# Altium project ECE299_PCB.PrjPcb
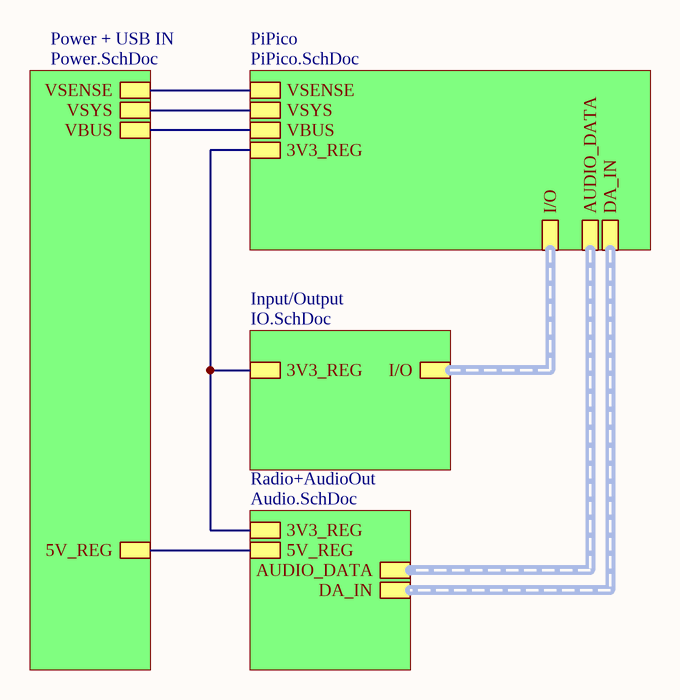
[diagram p0: Main.SchDoc]
5 sheets, 107 parts. Net scope: flat (ports and power ports of the same name join across sheets).
Board file: Main.PcbDoc
Sheets:
  Main.SchDoc
    Radio+AudioOut = Audio.SchDoc
    Input/Output = IO.SchDoc
    Power + USB IN = Power.SchDoc
    PiPico = PiPico.SchDoc

## Sheet Main.SchDoc
size A; SheetNumber: 1; SheetTotal: 5

### Sub-sheets
Input/Output = IO.SchDoc: 3V3_REG, I/O
PiPico = PiPico.SchDoc: I/O (harness IOSigHarn), VBUS, 3V3_REG, VSENSE, VSYS, AUDIO_DATA (harness AUDIO_DATA), DA_IN (harness DA_IN)
Power + USB IN = Power.SchDoc: VBUS, VSENSE, 5V_REG, VSYS
Radio+AudioOut = Audio.SchDoc: 3V3_REG, 5V_REG, AUDIO_DATA (harness AUDIO_DATA), DA_IN (harness DA_IN)

### Nets
(unnamed): sheet Radio+AudioOut/3V3_REG, sheet Input/Output/3V3_REG, sheet PiPico/3V3_REG
(unnamed): sheet Radio+AudioOut/5V_REG, sheet Power + USB IN/5V_REG
(unnamed): sheet Power + USB IN/VBUS, sheet PiPico/VBUS
(unnamed): sheet Power + USB IN/VSENSE, sheet PiPico/VSENSE
(unnamed): sheet Power + USB IN/VSYS, sheet PiPico/VSYS

### Buses and harness runs
harness sheet Input/Output/I/O = sheet PiPico/I/O
harness sheet PiPico/AUDIO_DATA = sheet Radio+AudioOut/AUDIO_DATA
harness sheet PiPico/DA_IN = sheet Radio+AudioOut/DA_IN

## Sheet Audio.SchDoc
size B; SheetNumber: 2; SheetTotal: 5
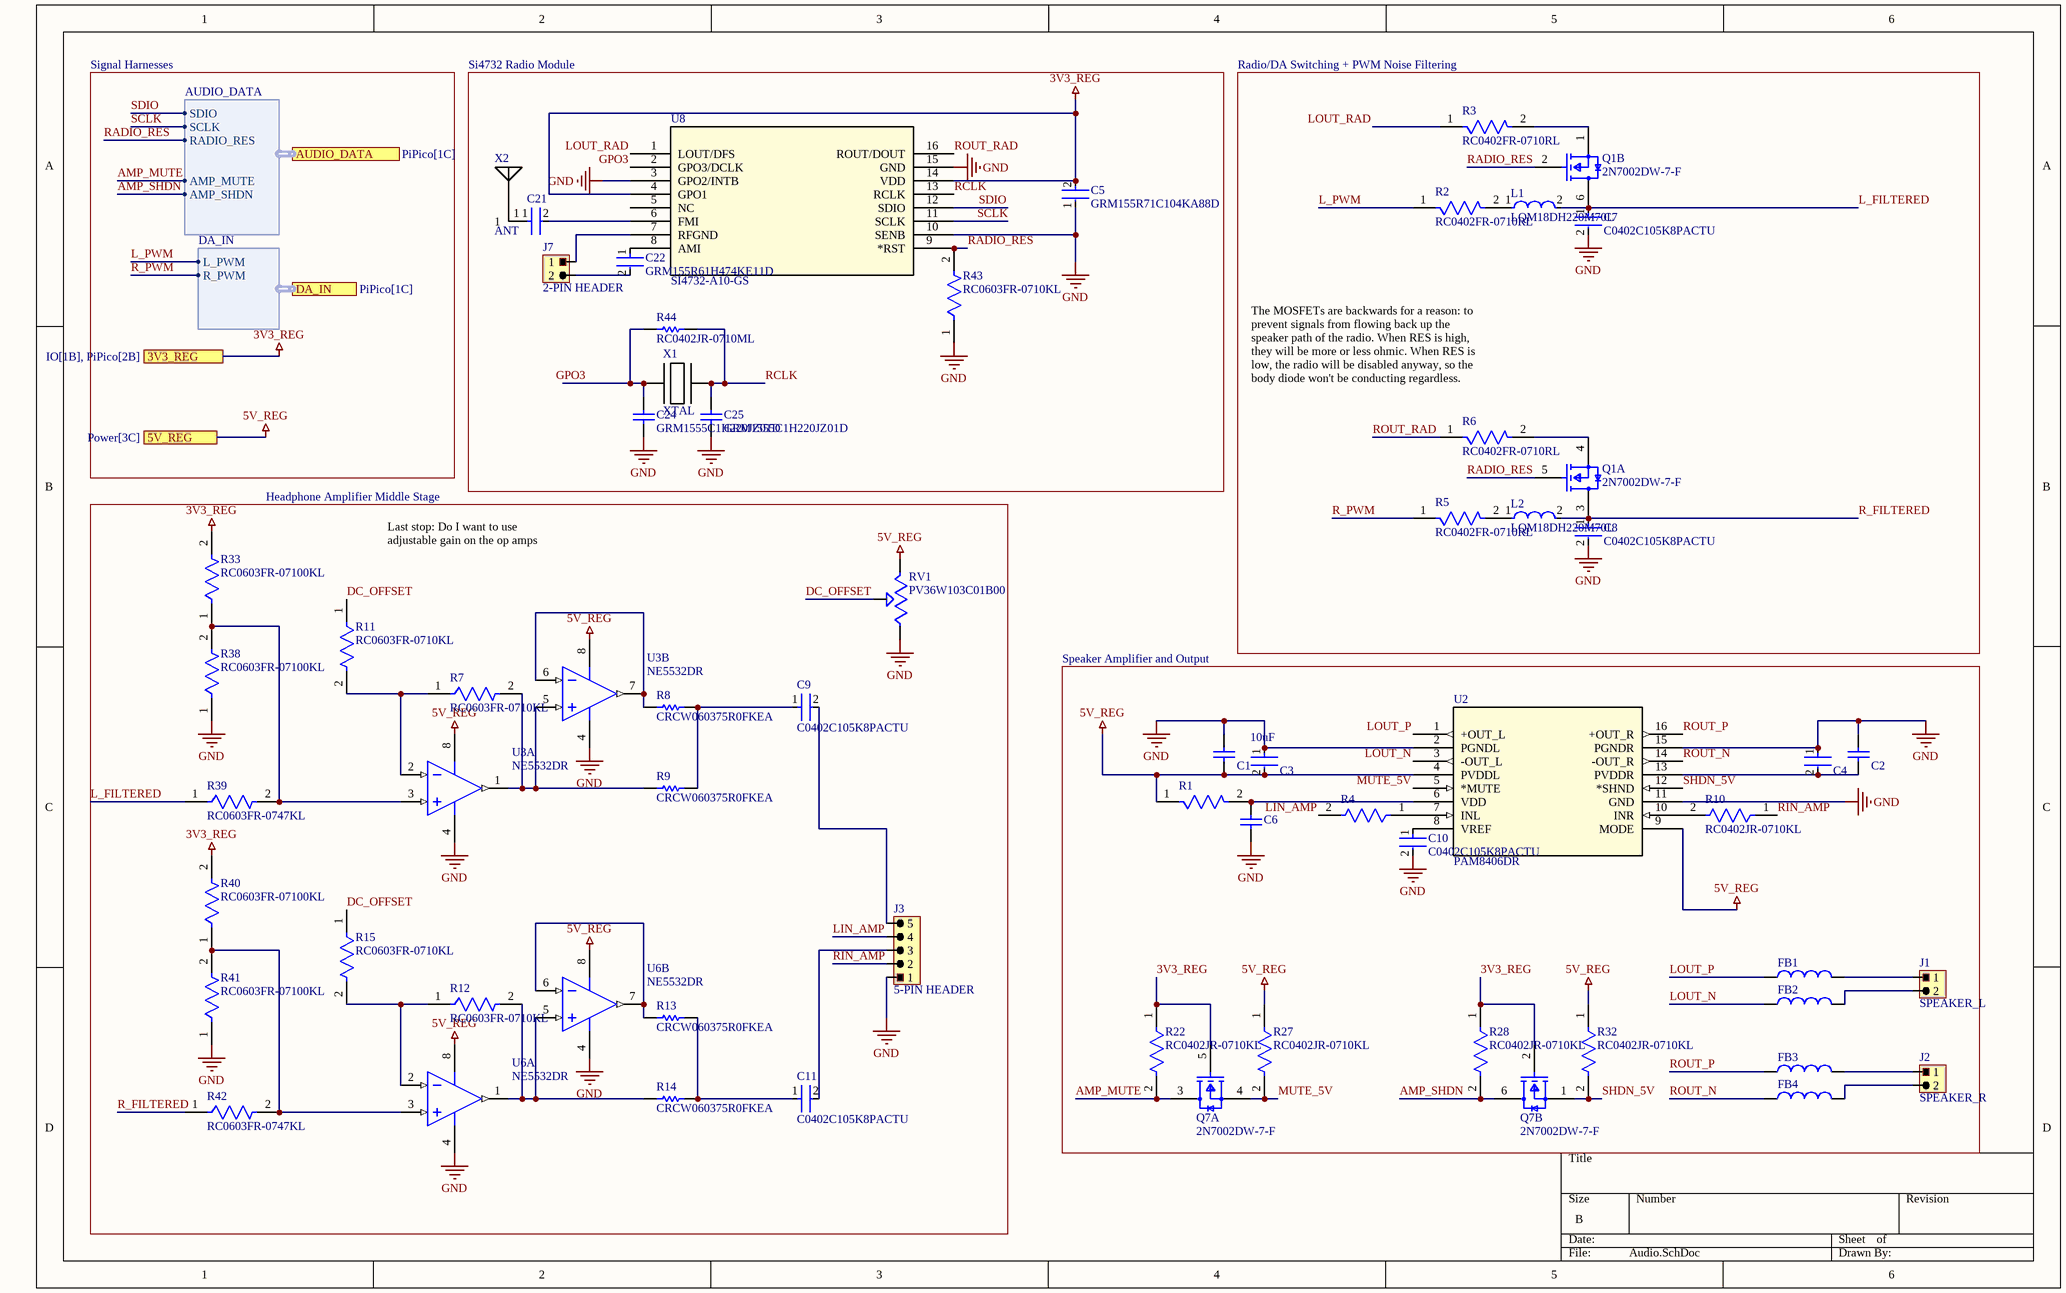
[diagram p1: Audio.SchDoc]

### Parts
C1  C0603C105K3RACTU  [CAPC1608X87X35LL15T15]  (value not drawn)
C2  C0603C105K3RACTU  [CAPC1608X87X35LL15T15]  (value not drawn)
C3  Capacitance: 10uF  [FP-C0805C-DG-MFG]  (hidden comment: C0805C106K8PACTU)
C4  C0805C106K8PACTU  [FP-C0805C-DG-MFG]  (value not drawn)
C5  GRM155R71C104KA88D  [FP-GRM15-MFG]
C6  C0603C105K3RACTU  [CAPC1608X87X35LL15T15]  (value not drawn)
C7  C0402C105K8PACTU  [FP-C0402C105K8PACTU-MFG]
C8  C0402C105K8PACTU  [FP-C0402C105K8PACTU-MFG]
C9  C0402C105K8PACTU  [FP-C0402C105K8PACTU-MFG]
C10  C0402C105K8PACTU  [FP-C0402C105K8PACTU-MFG]
C11  C0402C105K8PACTU  [FP-C0402C105K8PACTU-MFG]
C21  GRM1555C1H102JA01D  [FP-GRM155-0_05-IPC_B]  (value not drawn)
C22  GRM155R61H474KE11D  [FP-GRM155-0_1-IPC_B]
C24  GRM1555C1H220JZ01D  [CAPC1005X55X25NL05T10]
C25  GRM1555C1H220JZ01D  [CAPC1005X55X25NL05T10]
FB1  742792097  [WE-CBF_0805_L2W1.2H0.9_HC]  (value not drawn)
FB2  742792097  [WE-CBF_0805_L2W1.2H0.9_HC]  (value not drawn)
FB3  742792097  [WE-CBF_0805_L2W1.2H0.9_HC]  (value not drawn)
FB4  742792097  [WE-CBF_0805_L2W1.2H0.9_HC]  (value not drawn)
J1  SPEAKER_L  [2-pin Header (Generic)]
J2  SPEAKER_R  [2-pin Header (Generic)]
J3  5-PIN HEADER  [5-pin Header (Generic)]
J7  2-PIN HEADER  [2-pin Header (Generic)]
L1  LQM18DH220M70L  [FP-LQM18DN_70-MFG]
L2  LQM18DH220M70L  [FP-LQM18DN_70-MFG]
Q1  2N7002DW-7-F  [FP-SOT363-IPC_C]  (parts A,B of 2)
Q7  2N7002DW-7-F  [FP-SOT363-IPC_C]  (parts A,B of 2)
R1  RC0402FR-0710RL  [FP-RC0402-0_4-MFG]  (value not drawn)
R2  RC0402FR-0710RL  [FP-RC0402-0_4-MFG]
R3  RC0402FR-0710RL  [FP-RC0402-0_4-MFG]
R4  RC0402JR-0710KL  [RC0402N_YAG]  (value not drawn)
R5  RC0402FR-0710RL  [FP-RC0402-0_4-MFG]
R6  RC0402FR-0710RL  [FP-RC0402-0_4-MFG]
R7  RC0603FR-0710KL  [FP-RC0603-0_55-IPC_C]
R8  CRCW060375R0FKEA  [RESC1609X50X30LL10T20]
R9  CRCW060375R0FKEA  [RESC1609X50X30LL10T20]
R10  RC0402JR-0710KL  [RC0402N_YAG]
R11  RC0603FR-0710KL  [FP-RC0603-0_55-IPC_C]
R12  RC0603FR-0710KL  [FP-RC0603-0_55-IPC_C]
R13  CRCW060375R0FKEA  [RESC1609X50X30LL10T20]
R14  CRCW060375R0FKEA  [RESC1609X50X30LL10T20]
R15  RC0603FR-0710KL  [FP-RC0603-0_55-IPC_C]
R22  RC0402JR-0710KL  [RC0402N_YAG]
R27  RC0402JR-0710KL  [RC0402N_YAG]
R28  RC0402JR-0710KL  [RC0402N_YAG]
R32  RC0402JR-0710KL  [RC0402N_YAG]
R33  RC0603FR-07100KL  [FP-RC0603-0_55-MFG]
R38  RC0603FR-07100KL  [FP-RC0603-0_55-MFG]
R39  RC0603FR-0747KL  [FP-RC0603FR-0747KL-MFG]
R40  RC0603FR-07100KL  [FP-RC0603-0_55-MFG]
R41  RC0603FR-07100KL  [FP-RC0603-0_55-MFG]
R42  RC0603FR-0747KL  [FP-RC0603FR-0747KL-MFG]
R43  RC0603FR-0710KL  [FP-RC0603-0_55-IPC_C]
R44  RC0402JR-0710ML  [RESC1005X40X25ML05T10]
RV1  PV36W103C01B00  [TRIM_PV36W103C01B00]
U2  PAM8406DR  [SO-16_PAM8406_DIO]
U3  NE5532DR  [D0008A_N]  (parts A,B of 2)
U6  NE5532DR  [D0008A_N]  (parts A,B of 2)
U8  SI4732-A10-GS  [SOIC_A10-GS_SIL]
X1  XTAL  [FC-135 32.7680KA-AG0]
X2  ANT  [FM_ANTENNA_OUT]

### Blocks framed on the sheet
Si4732 Radio Module: C5 C21 C22 C24 C25 J7 R43 R44 U8 X1 X2
Radio/DA Switching + PWM Noise Filtering: C7 C8 L1 L2 Q1 R2 R3 R5 R6
Headphone Amplifier Middle Stage: C9 C11 J3 R7-R9 R11-R15 R33 R38-R42 RV1 U3 U6
Speaker Amplifier and Output: C1-C4 C6 C10 FB1-FB4 J1 J2 Q7 R1 R4 R10 R22 R27 R28 R32 U2

### Ports
3V3_REG (see IO[1B], PiPico[2B]), 5V_REG (see Power[3C]), AUDIO_DATA (harness AUDIO_DATA, see PiPico[1C]), DA_IN (harness DA_IN, see PiPico[1C])

### Harnesses
AUDIO_DATA: SDIO, SCLK, AMP_MUTE, AMP_SHDN, RADIO_RES
DA_IN: L_PWM, R_PWM

### Nets
3V3_REG: C5.2 Q7.2(G2) Q7.5(G1) R22.1 R28.1 R33.2 R40.2 U8.4(GPO1) U8.14(VDD) ; port 3V3_REG
5V_REG: C1.1 C3.2 R1.1 R27.1 R32.1 RV1.3 U2.4(PVDDL) U2.9(MODE) U3.8(VCC+) U6.8(VCC+) ; port 5V_REG  [project net 5V_OUT]
GND: C1.2 C2.2 C3.1 C4.1 C5.1 C6.1 C7.2 C8.2 C10.2 C24.1 C25.1 J3.1 R38.1 R41.1 R43.1 RV1.1 U2.2(PGNDL) U2.11(GND) U2.15(PGNDR) U3.4(VCC-) U6.4(VCC-) U8.3(GPO2/INTB) U8.10(SENB) U8.15(GND)
AMP_MUTE: Q7.3(D1) R22.2 ; port AUDIO_DATA.AMP_MUTE
AMP_SHDN: Q7.6(D2) R28.2 ; port AUDIO_DATA.AMP_SHDN
DC_OFFSET: R11.1 R15.1 RV1.2  [project net DC_OFFSET_2]
GPO3: C24.2 R44.1 U8.2(GPO3/DCLK) X1.2  [project net GPO3_2]
L_FILTERED: C7.1 L1.2 Q1.6(D2) R39.1  [project net L_FILTERED_2]
L_PWM: R2.1 ; port DA_IN.L_PWM
LIN_AMP: J3.4 R4.2  [project net LIN_AMP_2]
LOUT_N: FB2.1 U2.3(-OUT_L)  [project net LOUT_N_2]
LOUT_P: FB1.1 U2.1(+OUT_L)  [project net LOUT_P_2]
LOUT_RAD: R3.1 U8.1(LOUT/DFS)  [project net LOUT_RAD_2]
MUTE_5V: Q7.4(S1) R27.2 U2.5(*MUTE)  [project net MUTE_5V_2]
R_FILTERED: C8.1 L2.2 Q1.3(D1) R42.1  [project net R_FILTERED_2]
R_PWM: R5.1 ; port DA_IN.R_PWM
RADIO_RES: Q1.2(G2) Q1.5(G1) R43.2 U8.9(*RST) ; port AUDIO_DATA.RADIO_RES
RCLK: C25.2 R44.2 U8.13(RCLK) X1.1  [project net RCLK_2]
RIN_AMP: J3.2 R10.1  [project net RIN_AMP_2]
ROUT_N: FB4.1 U2.14(-OUT_R)  [project net ROUT_N_2]
ROUT_P: FB3.1 U2.16(+OUT_R)  [project net ROUT_P_2]
ROUT_RAD: R6.1 U8.16(ROUT/DOUT)  [project net ROUT_RAD_2]
SCLK: U8.11(SCLK) ; port AUDIO_DATA.SCLK  [project net I2C_SCLK]
SDIO: U8.12(SDIO) ; port AUDIO_DATA.SDIO  [project net I2C_SDIO]
SHDN_5V: Q7.1(S2) R32.2 U2.12(*SHND)  [project net SHDN_5V_2]
NetC2_1: C2.1 C4.2 U2.13(PVDDR)
NetC6_2: C6.2 R1.2 U2.6(VDD)
NetC9_1: C9.1 R8.2 R9.2
NetC9_2: C9.2 J3.5
NetC10_1: C10.1 U2.8(VREF)
NetC11_1: C11.1 R13.2 R14.2
NetC11_2: C11.2 J3.3
NetC21_1: C21.1 X2.1
NetC21_2: C21.2 U8.6(FMI)
NetC22_1: C22.1 U8.8(AMI)
NetC22_2: C22.2 J7.2
NetFB1_2: FB1.2 J1.1
NetFB2_2: FB2.2 J1.2
NetFB3_2: FB3.2 J2.1
NetFB4_2: FB4.2 J2.2
NetJ7_1: J7.1 U8.7(RFGND)
NetL1_1: L1.1 R2.2
NetL2_1: L2.1 R5.2
NetQ1_1: Q1.1(S2) R3.2
NetQ1_4: Q1.4(S1) R6.2
NetR4_1: R4.1 U2.7(INL)
NetR7_1: R7.1 R11.2 U3.2(IN1-)
NetR7_2: R7.2 R9.1 U3.1(OUT1) U3.5(IN2+)
NetR8_1: R8.1 U3.6(IN2-) U3.7(OUT2)
NetR10_2: R10.2 U2.10(INR)
NetR12_1: R12.1 R15.2 U6.2(IN1-)
NetR12_2: R12.2 R14.1 U6.1(OUT1) U6.5(IN2+)
NetR13_1: R13.1 U6.6(IN2-) U6.7(OUT2)
NetR33_1: R33.1 R38.2 R39.2 U3.3(IN1+)
NetR40_1: R40.1 R41.2 R42.2 U6.3(IN1+)

Not connected (* = marked no-connect by the designer): U8 5(NC)

### Notes on the sheet
- Signal Harnesses
- (near R6) The MOSFETs are backwards for a reason: to prevent signals from flowing back up the speaker path of the radio. When RES is high, they will be more or less ohmic. When RES is low, the radio will be disabled anyway, so the body diode won't be conducting regardless.
- Last stop: Do I want to use adjustable gain on the op amps

### Library data of the parts
C1 C2 C6 = CMP-2006-03713-1: Manufacturer: Kemet; Part Number: C0603C105K3RACTU
C3 C4 = CMP-2007-03243-2: CAP CER 10UF 10V X5R 0805; Manufacturer: Kemet; 3DS Part Number: 220-00001; Tolerance: 10%; Temperature Coefficient: 15%; Material: Ceramic; Device Class L2: Capacitors; Device Class L1: Passive Components; ComponentLink2URL: https://content.kemet.com/datasheets/KEM_C1006_X5R_SMD.pdf; Height: 1.4mm; Lead Free: Yes; Manufacturer Part Number: C0805C106K8PACTU; Digikey Description: CAP CER 10UF 10V X5R 0805; Octopart: https://octopart.com/c0805c106k8pactu-kemet-98697; Value: 10uF; Temperature Range Low: -55°C; Temperature: -55°C to +85°C; Automotive: No; Mouser Description: CAP CER 10UF 10V X5R 0805; Ipc Land Pattern Name: CAPC200125X125; Temperature Range High: +85°C; Voltage: 10V; RoHS: TRUE; Device Class L3: Ceramic Capacitors; ComponentLink2Description: Datasheet; Voltage Rating: 10V; Package: C0805C-DG; Temperature Characteristic: X5R; Category: Cap
  C4: Capacitance: 10uF
C5 = CMP-2100-03641-2: CAP CER 0.1UF 16V X7R 0402; Manufacturer: Murata; Standoff Height: 0mm; Tolerance: 10%; Description: CAP Ceramic 0.10μF 10% X7R 16Vdc 0402 SMD; Voltage Rating: 16Vdc; Material: Ceramic; Capacitance: 0.10μF; Value: 0.10μF; RoHS: TRUE; Manufacturer Part Number: GRM155R71C104KA88D; Temperature Characteristic: X7R; Octopart: https://octopart.com/grm155r71c104ka88d-murata-196880; Digikey Description: CAP CER 0.1UF 16V X7R 0402; Device Class L3: Ceramic Capacitors; Height: 0.55mm; ComponentLink2Description: Datasheet; Temperature Range Low: -55°C; Ipc Land Pattern Name: CAPC10050X219; ComponentLink2URL: https://search.murata.co.jp/Ceramy/image/img/A01X/G101/ENG/GRM155R71H471KA01-01A.pdf; Device Class L1: Passive Components; Lead Free: yes; Category: Cap; Package: GRM15; Temperature: -55°C to +125°C; Device Class L2: Capacitors; Temperature Range High: +125°C; Mouser Description: 0402 0.1 uF 16V ±10 % Tolerance X7R SMT Multilayer Ceramic Capacitor
C7-C11 = CMP-2008-02081-2: CAP CER 1UF 10V X5R 0402; Dielectric Material: Ceramic; Dissipation Factor: 5%; Tolerance: 10%; Number of Pins: 2; Contact Plating: Tin; Min Operating Temperature: -55°C; Termination: SMD/SMT; Lead Free: Lead Free; Construction: Flat; Voltage Rating (DC): 10V; Mount: Surface Mount; Series: C; Thickness: 0.022inch; Width: 0.5mm; Radiation Hardening: No; Capacitance: 1uF; Dielectric: X5R; Height: 0.5mm; Voltage: 10V; Length: 1mm; Depth: 0.5mm; Max Operating Temperature: 85°C; Package Quantity: 1; Packaging: Tape and Reel; RoHS Compliant: Yes; Case Code (Imperial): 0402; Case Code (Metric): 1005; REACH SVHC: No SVHC; Voltage Rating: 10V; Case/Package: 0402
C21 = CMP-2008-04254-2: Chip Multilayer Ceramic Capacitors for General Purpose, 0402, 1000pF, C0G, 30ppm/°C, 5%, 50V; Insulation Resistance: 10GR; Capacitance: 1nF; Packaging: Tape and Reel; Lead Free: Lead Free; Tolerance: 5%; Temperature Coefficient: 30ppm/°C; Thickness: 0.022inch; Termination: SMD/SMT; Max Operating Temperature: 125°C; Height: 0.5mm; Package Quantity: 1; Radiation Hardening: No; Material: Ceramic; Case Code (Metric): 1005; Number of Pins: 2; Voltage Rating: 50V; Mount: Surface Mount; Voltage: 50V; Case/Package: 0402; Min Operating Temperature: -55°C; Dielectric Material: Ceramic; Width: 0.5mm; Depth: 0.5mm; Case Code (Imperial): 0402; REACH SVHC: No SVHC; Dielectric: C0G; Voltage Rating (DC): 50V; Length: 1mm
C22 = CMP-06035-008741-1: Chip Multilayer Ceramic Capacitors for General Purpose, 0402, 0.47uF, X5R, 15%, 10%, 50V; Capacitance: 470nF; Dielectric: X5R; Voltage Rating (DC): 50V; Width: 500um; Tolerance: 10%; Length: 1mm; Thickness: 500um
C24 C25 = CMP-2008-04304-1: Manufacturer: Murata; Part Number: GRM1555C1H220JZ01D
FB1-FB4 = CMP-0220-00149-3: NexarPartId: 22803129; Max Current Rating: 1A; Inductance: 1.8nH; Resistance: 300mΩ; Number of Lines: 1; Test Frequency: 100MHz; Tolerance: 25%; Impedance: 1.5kΩ; Min Operating Temperature: -55°C; Core Material: Ferrite; Depth: 1.2mm; Lead Free: Lead Free; Length: 2mm; Packaging: Digi-Reel®; Case Code (Imperial): 0805; Current Rating: 1A; Max Operating Temperature: 125°C; Case Code (Metric): 2012; RoHS: Compliant; RMS Current (Irms): 1A; Mount: Surface Mount; Material: Ferrite; DC Resistance (DCR): 300mΩ; Height: 900µm; Series Resistance: 300mΩ; Termination: SMD/SMT; Max DC Current: 1A; Weight: 10.999615mg; REACH SVHC: Unknown; Width: 1.2mm; Case/Package: 0805
J1 J2 = 2-PIN HEADER
L1 L2 = CMP-00260-119446615-1: LQM18DH220M70L Inductor Chip Shielded Multilayer 22uH 20% 1MHz Ferrite 200mA 0603 Emboss T/R; Series Resistance: 3.12Ω; Self Resonant Frequency: 15MHz; Inductance: 22µH; Saturation Current: 50mA; NexarPartId: 119446615; Test Frequency: 1MHz; Resistance: 3.12Ω; Tolerance: 20%; Min Operating Temperature: -55°C; Max Operating Temperature: 150°C; RMS Current (Irms): 200mA; Lifecycle Status: Production; Height: 950µm; Case/Package: 0603; Core Material: Ferrite
Q1 Q7 = CMP-2000-05563-2: MOSFET 2N-CH 60V 0.23A SOT-363; Input Capacitance: 50pF; Rds On Max: 7.5R; Continuous Drain Current (ID): 115mA; Element Configuration: Dual; Threshold Voltage: 2V; Number of Channels: 2; Turn-Off Delay Time: 11ns; Max Power Dissipation: 200mW; Power Dissipation: 400mW; Drain to Source Breakdown Voltage: 70V; FET Type: 2 N-Channel; Turn-On Delay Time: 7ns; Drain to Source Resistance: 4.4R; Gate to Source Voltage (Vgs): 20V; Height: 1mm; REACH SVHC: No SVHC; Package Quantity: 3000; Width: 1.35mm; On-State Resistance: 7.5R; Case/Package: SOT-363; Lead Free: Lead Free; Voltage Rating (DC): 60V; Contact Plating: Tin; Drain to Source Voltage (Vdss): 60V; Packaging: Tape and Reel; Number of Pins: 6; Current Rating: 115mA; Nominal Vgs: 2V; Length: 2.2mm; Termination: SMD/SMT; Max Operating Temperature: 150°C; Dual Supply Voltage: 60V; Weight: 0.000212oz; Radiation Hardening: No; Min Operating Temperature: -55°C; Number of Elements: 2; Mount: Surface Mount
R1-R3 R5 R6 = CMP-2002-07358-2: NexarPartId: 55458463; Tolerance: 1%; Working Voltage: 50V; Power Rating: 63mW; Temperature Coefficient: 100ppm/°C; Resistance: 10Ω; Packaging: Tape & Reel; RoHS: Compliant; Case/Package: 0402; Voltage Rating (AC): 50V; Width: 500µm; Voltage Rating (DC): 50V; Termination: SMD/SMT; REACH SVHC: Unknown; Military Standard: Not; Number of Pins: 2; Lead Free: Lead Free; Schedule B: 8533210045, 8533210045; Max Operating Temperature: 155°C; Voltage Rating: 50V; Case Code (Metric): 0402; Length: 1mm; Min Operating Temperature: -55°C; Case Code (Imperial): 0402; Height: 320µm; Composition: Thick Film; Depth: 500µm; Number of Terminations: 2
R4 R10 R22 R27 R28 R32 = CMP-2002-07915-3: RES 10K OHM 5% 1/16W 0402; Max Power Dissipation: 63mW; Temperature Coefficient: 100ppm/°C; Power Rating: 62.5mW; Resistance: 10kR; Voltage Rating: 50V; Size Code: 0402; Resistance Tolerance: 5%; Packaging: Tape and Reel; Case Code (Metric): 1005; Lead Free: Lead Free; Resistor Type: Thick Film; Min Operating Temperature: -55°C; Military Standard: Not; Depth: 0.5mm; Series: RC; Case/Package: 0402; Construction: Rectangular; Number of Terminations: 2; Package Quantity: 1; Termination: SMD/SMT; Length: 0.039inch; Case Code (Imperial): 0402; Height: 0.016inch; Features: Moisture Resistant; RoHS Compliant: Yes; Max Operating Temperature: 155°C; Tolerance: 5%; Width: 0.02inch
R7 R11 R12 R15 R43 = CMP-2100-03664-2: RES 10K OHM 1% 1/10W 0603; Voltage Rating: 75V; Voltage Rating (DC): 50V; Resistance: 10kR; Power Rating: 100mW; Temperature Coefficient: 100ppm/°C; Depth: 0.8mm; Termination: SMD/SMT; Resistor Type: Thick Film; Series: RC; Construction: Rectangular; Features: Moisture Resistant; Packaging: Tape and Reel; Min Operating Temperature: -55°C; Number of Terminations: 2; Lead Pitch: 0.3mm; RoHS Compliant: Yes; Case/Package: 0603; Resistance Tolerance: 1%; Military Standard: Not; Weight: 7.1E-05oz; Number of Pins: 2; Tolerance: 1%; Length: 1.6mm; Case Code (Imperial): 0603; Lead Free: Lead Free; Width: 0.8mm; Max Power Dissipation: 100mW; Height: 0.45mm; Max Operating Temperature: 155°C; Case Code (Metric): 1608; Size Code: 0603
R8 R9 R13 R14 = CMP-2000-03573-1: Manufacturer: Vishay Dale; Part Number: CRCW060375R0FKEA
R33 R38 R40 R41 = CMP-2100-03662-2: RES SMD 100K OHM 1% 1/10W 0603; Voltage Rating (DC): 50V; Resistance: 100kR; Max Power Dissipation: 100mW; Temperature Coefficient: 100ppm/°C; Working Voltage: 75V; Length: 1.6mm; Lead Free: Lead Free; Number of Terminations: 2; Packaging: Tape and Reel; Voltage Rating: 50V; Termination: SMD/SMT; Width: 0.8mm; Resistor Type: Thick Film; Resistance Tolerance: 1%; Features: Moisture Resistant; Height: 0.45mm; Construction: Rectangular; Case/Package: 0603; Military Standard: Not; Case Code (Imperial): 0603; Series: RC; Technology: THICK FILM; Depth: 0.8mm; RoHS Compliant: Yes; REACH SVHC: No SVHC; Min Operating Temperature: -55°C; Case Code (Metric): 1608; Max Operating Temperature: 155°C; Power Rating: 100mW; Number of Pins: 2; Tolerance: 1%
R39 R42 = CMP-1659-00055-2: RES SMD 47K OHM 1% 1/10W 0603; Voltage Rating: 50V; Temperature Coefficient: 100ppm/°C; Max Power Dissipation: 100mW; Resistance: 47kR; Voltage Rating (DC): 50V; Min Operating Temperature: -55°C; Packaging: Tape and Reel; Features: Moisture Resistant; Termination: SMD/SMT; Technology: THICK FILM; Lead Free: Lead Free; Max Operating Temperature: 155°C; Width: 0.031inch; Case Code (Metric): 1608; Tolerance: 1%; Package Quantity: 1; Resistor Type: Thick Film; RoHS Compliant: Yes; Case/Package: 0603; Case Code (Imperial): 0603; Resistance Tolerance: 1%; Length: 0.063inch; Series: RC; Number of Pins: 2; Power Rating: 100mW; Number of Terminations: 2; Construction: Rectangular; Height: 0.022inch; Military Standard: Not; Size Code: 0603; Depth: 0.8mm
R44 = CMP-2002-07916-1: Manufacturer: Yageo / Phycomp; Part Number: RC0402JR-0710ML
RV1 = PV36W103C01B00: 10 kOhms 0.5W, 1/2W PC Pins Through Hole Trimmer Potentiometer Cermet 25.0 Turn Top Adjustment; MF: Bourns; DigiKey_Part_Number: 118-PV36W103C01B00-ND; Purchase-URL: https://pricing.snapeda.com/search?q=PV36W103C01B00&ref=eda; Package: PV36W Bourns; Check_prices: https://www.snapeda.com/parts/PV36W103C01B00/Bourns/view-part/?ref=eda; Value: *; SnapEDA_Link: https://www.snapeda.com/parts/PV36W103C01B00/Bourns/view-part/?ref=snap; MP: PV36W103C01B00
U2 = PAM8406DR: No Description Available; Mfr_Name: Diodes Inc; RefDes: RefDes; Type: Type
U3 U6 = CMP-0015-00074-2: Dual Low-Noise High-Speed Audio Operational Amplifier, 10 to 30 V, 0 to 70 degC, 8-pin SOIC (D8), Green (RoHS & no Sb/Br); Manufacturer: Texas Instruments; Vn at 1kHz(Typ)(nV/rtHz): 5; Total Supply Voltage(Max)(+5V is 5, +/-5V is 10): 30; Number of Channels: 2; CMRR(Min)(dB): 70; GBW(Typ)(MHz): 10; IIB(Max)(pA): 800000; Sub Family: General Purpose Amplifier, High Supply Voltage Amplifier (>=30V), Low Noise Amp (<=10nV/rtHz); Iq per channel(Max)(mA): 4; Slew Rate(Typ)(V/us): 9; ComponentLink3Description: Package Specification; Mounting Technology: Surface Mount; PackageVersion: 4040047-3/M, 06/2011; PackageReference: D0008A; ComponentLink2Description: Datasheet; PackageDescription: 8-Pin Plastic Small Outline, Body 4.9 x 3.9 mm, Pitch 1.27 mm; PartNumber: NE5532DR; ComponentLink1URL: http://www.ti.com/; ComponentLink3URL: http://www.ti.com/litv/pdf/msoi002j; Code_JEDEC: MS-012; Eco-Plan: Green (RoHS & no Sb/Br); ComponentLink1Description: Manufacturer URL; Total Supply Voltage(Min)(+5V is 5, +/-5V is 10): 10; ComponentLink2URL: http://www.ti.com/lit/ds/symlink/ne5532.pdf; Vio (25C)(Max)(mV): 4; DatasheetVersion: SLOS075I
U8 = SI4732-A10-GS: No Description Available; Mfr_Name: Silicon Labs; RefDes: RefDes; Type: Type
X1 = FC-135 32.7680KA-AG0
X2 = FM_OUT

## Sheet IO.SchDoc
size A; SheetNumber: 3; SheetTotal: 5
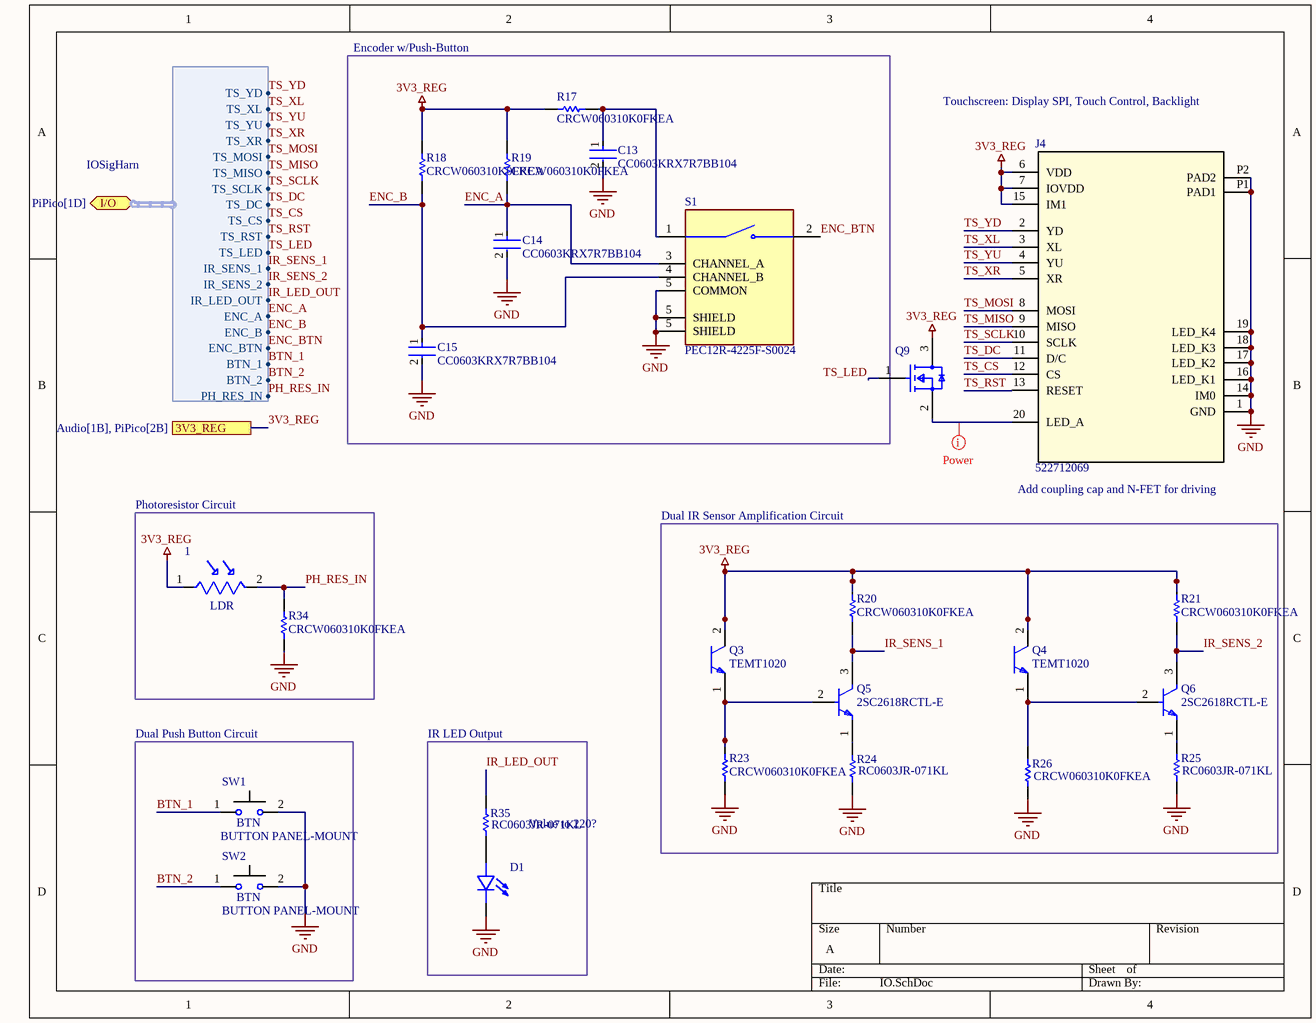
[diagram p2: IO.SchDoc]

### Parts
1  LDR  [2-pin Header (Generic)]
C13  CC0603KRX7R7BB104  [FP-CC0603-DA-MFG]
C14  CC0603KRX7R7BB104  [FP-CC0603-DA-MFG]
C15  CC0603KRX7R7BB104  [FP-CC0603-DA-MFG]
D1  (no value)  [2-pin Header (Generic)]
J4  522712069  [CON_522712069_MOL]
Q3  TEMT1020  [FP-6_544-5325_01-4-MFG]
Q4  TEMT1020  [FP-6_544-5325_01-4-MFG]
Q5  2SC2618RCTL-E  [PLSP0003ZB-A_P213_MFG]
Q6  2SC2618RCTL-E  [PLSP0003ZB-A_P213_MFG]
Q9  2N7002H6327XTSA2  [FP-PG-SOT23-3-MFG]  (value not drawn)
R17  CRCW060310K0FKEA  [RESC1609X50X30NL8T20]
R18  CRCW060310K0FKEA  [RESC1609X50X30NL8T20]
R19  CRCW060310K0FKEA  [RESC1609X50X30NL8T20]
R20  CRCW060310K0FKEA  [RESC1609X50X30NL8T20]
R21  CRCW060310K0FKEA  [RESC1609X50X30NL8T20]
R23  CRCW060310K0FKEA  [RESC1609X50X30NL8T20]
R24  RC0603JR-071KL  [RESC1608X55X25ML10T15]
R25  RC0603JR-071KL  [RESC1608X55X25ML10T15]
R26  CRCW060310K0FKEA  [RESC1609X50X30NL8T20]
R34  CRCW060310K0FKEA  [RESC1609X50X30NL8T20]
R35  RC0603JR-071KL  [RESC1608X55X25ML10T15]
S1  PEC12R-4225F-S0024  [5-pin Header (Generic)]
SW1  BUTTON PANEL-MOUNT  [2-pin Header (Generic)]
SW2  BUTTON PANEL-MOUNT  [2-pin Header (Generic)]

### Blocks framed on the sheet
Encoder w/Push-Button: C13-C15 R17-R19 S1
Photoresistor Circuit: 1 R34
Dual IR Sensor Amplification Circuit: Q3-Q6 R20 R21 R23-R26
Dual Push Button Circuit: SW1 SW2

### Ports
3V3_REG (see Audio[1B], PiPico[2B]), I/O (bidir, harness IOSigHarn, see PiPico[1D])

### Harnesses
IOSigHarn: TS_YD, TS_XL, TS_YU, TS_XR, TS_MOSI, TS_MISO, TS_SCLK, TS_DC, TS_CS, TS_RST, TS_LED, IR_SENS_1, IR_SENS_2, IR_LED_OUT, ENC_A, ENC_B, ENC_BTN, BTN_1, BTN_2, PH_RES_IN

### Nets
3V3_REG: 1.1 J4.6(VDD) J4.7(IOVDD) J4.15(IM1) Q3.2(C) Q4.2(C) Q9.3(drain) R17.2 R18.2 R19.2 R20.2 R21.2 ; port 3V3_REG
GND: C13.2 C14.2 C15.2 D1.1(C) J4.1(GND) J4.14(IM0) J4.16(LED_K1) J4.17(LED_K2) J4.18(LED_K3) J4.19(LED_K4) J4.P1(PAD1) J4.P2(PAD2) R23.1 R24.1 R25.1 R26.1 R34.1 S1.5(COMMON) SW1.2 SW2.2
BTN_1: SW1.1 ; port I/O.BTN_1
BTN_2: SW2.1 ; port I/O.BTN_2
ENC_A: C14.1 R19.1 S1.3(CHANNEL_A) ; port I/O.ENC_A
ENC_B: C15.1 R18.1 S1.4(CHANNEL_B) ; port I/O.ENC_B
ENC_BTN: S1.2 ; port I/O.ENC_BTN
IR_LED_OUT: R35.2 ; port I/O.IR_LED_OUT
IR_SENS_1: Q5.3(COLLECTOR) R20.1 ; port I/O.IR_SENS_1
IR_SENS_2: Q6.3(COLLECTOR) R21.1 ; port I/O.IR_SENS_2
PH_RES_IN: 1.2 R34.2 ; port I/O.PH_RES_IN
TS_CS: J4.12(CS) ; port I/O.TS_CS
TS_DC: J4.11(D/C) ; port I/O.TS_DC
TS_LED: Q9.1(gate) ; port I/O.TS_LED
TS_MISO: J4.9(MISO) ; port I/O.TS_MISO  [project net MISO]
TS_MOSI: J4.8(MOSI) ; port I/O.TS_MOSI  [project net MOSI]
TS_RST: J4.13(RESET) ; port I/O.TS_RST
TS_SCLK: J4.10(SCLK) ; port I/O.TS_SCLK  [project net SCLK]
TS_XL: J4.3(XL) ; port I/O.TS_XL
TS_XR: J4.5(XR) ; port I/O.TS_XR
TS_YD: J4.2(YD) ; port I/O.TS_YD
TS_YU: J4.4(YU) ; port I/O.TS_YU
NetC13_1: C13.1 R17.1 S1.1
NetD1_2: D1.2(A) R35.1
NetJ4_20: J4.20(LED_A) Q9.2(source)
NetQ3_1: Q3.1(E) Q5.2(BASE) R23.2
NetQ4_1: Q4.1(E) Q6.2(BASE) R26.2
NetQ5_1: Q5.1(EMITTER) R24.2
NetQ6_1: Q6.1(EMITTER) R25.2

### Layout directives
net class POWER: NetJ4_20

### Notes on the sheet
- Touchscreen: Display SPI, Touch Control, Backlight
- Add coupling cap and N-FET for driving
- IR LED Output
- Value to 220?
- (in symbol BUTTON PANEL-MOUNT) BTN

### Library data of the parts
1 = PHOTORESISTOR GENERIC: Generic Photoresistor symbol for peripheral use. / Uses generic 2-Pin Header footprint.
C13-C15 = CMP-2000-05002-2: CAP CER 0.1UF 16V X7R 0603; Manufacturer: YAGEO; Tolerance: 0.1; Value: 100 nF; Temperature Coefficient: 15%; Material: Ceramic; Voltage Rating: 16 V; Package: CC0603-DA; ComponentLink2Description: Datasheet; Octopart: https://octopart.com/cc0603krx7r7bb104-yageo-192941; Temperature Range High: +125°C; Digikey Description: CAP CER 0.1UF 16V X7R 0603; Voltage: 16 V; Device Class L2: Capacitors; Height: 0.9mm; Temperature: -55°C to +125°C; Manufacturer Part Number: CC0603KRX7R7BB104; Device Class L1: Passive Components; Device Class L3: Ceramic Capacitors; ComponentLink2URL: http://www.yageo.com/documents/recent/UPY-GPHC_X7R_6.3V-to-50V_18.pdf; Footprint Url: http://www.yageo.com/exep/pages/download/literatures/UPY-C_GEN_24.pdf; RoHS: TRUE; Temperature Range Low: -55°C; Temperature Characteristic: X7R; Lead Free: Yes; Capacitance: 100 nF; Category: Cap; Mouser Description: Multilayer Ceramic Capacitor, CC Series, 0.1 - F, - 10%, X7R, 16 V, 0603 [1608 Metric]; Automotive: No
D1 = APT1608SF4C-PRV: IR_LED; MF: {'manufacturer': u'Kingbright'}; Package: None; Price: None; Value: *; MP: APT1608SF4C-PRV; Availability: Unavailable
J4 = 522712069: Mfr_Name: Molex Connector Corporation; RefDes: RefDes; Type: Type
Q3 Q4 = CMP-02533-000001-1: SENSOR PHOTO 880NM TOP VIEW 2SMD; Manufacturer: Vishay Semiconductor Opto Division; Viewing Angle: 30°; Operating Supply Current: 7mA; Standoff Height: 0.08mm; Power Dissipation: 100mW; Max Junction Temp: +100°C; Collector Emitter Breakdown Voltage: 70V; Dark Current: 0.001uA; Max Collector Current: 50mA; Device Class L2: Optical Sensors; Package: 6.544-5325.01-4; ComponentLink2URL: http://www.vishay.com/doc?81554; Device Class L3: Phototransistor; Device Class L1: Sensors; Temperature: to +100°C; RoHS: TRUE; Temperature Range High: +100°C; Wavelength: 880nm; Lead Free: Yes; ComponentLink2Description: Datasheet; Category: Trans; Digikey Description: SENSOR PHOTO 880NM TOP VIEW 2SMD; Ambient Temperature Range Low: -40°C; Mouser Description: Phototransistors NPN Phototransistor; Automotive: No; Ambient Temperature Range High: +85°C; Octopart: https://octopart.com/temt1020-vishay-39666707; Manufacturer Part Number: TEMT1020; Led Orientation: Top View; Height: 2.98mm
Q5 Q6 = CMP-00572-10406399-1: Trans Gp Bjt NPN 35V 0.5A 3-PIN Mpak T/r; Manufacturer Lifecycle Status: OBSOLETE; Power Dissipation: 150mW; Emitter Base Voltage (VEBO): 4V; Number of Elements: 1; ComponentLink1Description: Manufacturer's Website; Max Operating Temperature: 150°C; Lead Free: Lead Free; ComponentLink1URL: http://www.renesas.com; China RoHS: Compliant; ComponentLink2Description: Datasheet URL; Polarity: NPN; ComponentLink3Description: Manufacturer's Package Drawing; ComponentLink3URL: https://www.renesas.com/en/document/psc/package-drawing-mpak-3pin-plsp0003zb; Width: 3mm; Min Operating Temperature: -55°C; Length: 2mm; Height: 1.3mm; Collector Emitter Voltage (VCEO): 35V; Mount: Surface Mount; Number of Pins: 3; Collector Base Voltage (VCBO): 35V; RoHS: Compliant; Radiation Hardening: No; HelpURL: https://octopart.com/cad-content/api/get-model-datasheet/15189/10406399; Lifecycle Status: Obsolete; ComponentLink2URL: https://octopart.com/cad-content/api/get-model-datasheet/15189/10406399
Q9 = CMP-32901-000180-1: MOSFET N-CH 60V 0.3A SOT23; Rise Time: 3.3ns; Input Capacitance: 20pF; Rds On Max: 3R; Gate to Source Voltage (Vgs): 20V; Continuous Drain Current (ID): 300mA; Max Power Dissipation: 500mW; Packaging: Tape and Reel; Mount: Surface Mount; Case/Package: SOT-23; Drain to Source Voltage (Vdss): 60V; Min Operating Temperature: -55°C; Halogen Free: Halogen Free; Max Dual Supply Voltage: 60V; Number of Pins: 3; Lead Free: Lead Free; Max Operating Temperature: 150°C
R17-R21 R23 R26 R34 = CMP-1666-00005-4: Chip Resistor, 10 KOhm, +/- 1%, 100 mW, -55 to 155 degC, 0603 (1608 Metric), RoHS, Tape and Reel; Manufacturer: Vishay Semiconductor; Voltage Rating: 75 V; Max Operating Temperature: 155 degC; PackageDescription: 2-Pin Surface Mount Device, Body 1.575 x 0.85 mm; ComponentLink1Description: Manufacturer URL; RoHSCompliant: true; PackageReference: 0603; REACH SVHC: Unknown; Length: 1.55 mm; DatasheetVersion: 06/2012; Packaging: Tape and Reel; Min Operating Temperature: -55 degC; Mounting Technology: Surface Mount; ComponentLink2URL: https://datasheet.ciiva.com/11809/0900766b80d98afc-11809037.pdf; Height: 0.45 mm; ComponentLink2Description: Datasheet; Package Quantity: 5000; ComponentLink1URL: http://www.vishay.com/
R24 R25 R35 = CMP-2000-05023-1: Chip Resistor, 1 KOhm, +/- 5%, 0.063 W, -55 to 155 degC, 0603 (1608 Metric), RoHS, Tape and Reel; Manufacturer: Yageo; Resistor Case Style: 0603[1608Metric]; Resistor Element Type: ThickFilm; Product Range: RCSeries; Resistance: 1kohm; SVHC: ToBeAdvised; Voltage Rating: 50V; Temperature Coefficient: ±100ppm/degC; Power Rating: 100mW; Packaging: CutTape; Manufacturer URL: http://www.yageo.com/; Resistance Tolerance: ±5%; Datasheet Version: Rev. 4, 04/2009; MSL: MSL1-Unlimited; Package Description: 2-Pin Surface Mount Device, Body 1.6 x 0.8 mm; Automotive Qualification Standard: -; Package Reference: 603; Datasheet URL: https://datasheet.ciiva.com/2452/pyu-rc0603-51-rohs-l-4-2452848.pdf
S1 = PEC12R-4225F-S0024: 24 Pulse Incremental Mechanical Rotary Encoder w/ 6 mm Flat Shaft,Through Hole | Bourns PEC12R-4225F-S0024; SnapEDA_Link: https://www.snapeda.com/parts/PEC12R-4225F-S0024/Bourns/view-part/?ref=snap; Package: None; Value: *; MF: Bourns; MP: PEC12R-4225F-S0024; Check_prices: https://www.snapeda.com/parts/PEC12R-4225F-S0024/Bourns/view-part/?ref=eda

## Sheet Power.SchDoc
size A; SheetNumber: 4; SheetTotal: 5
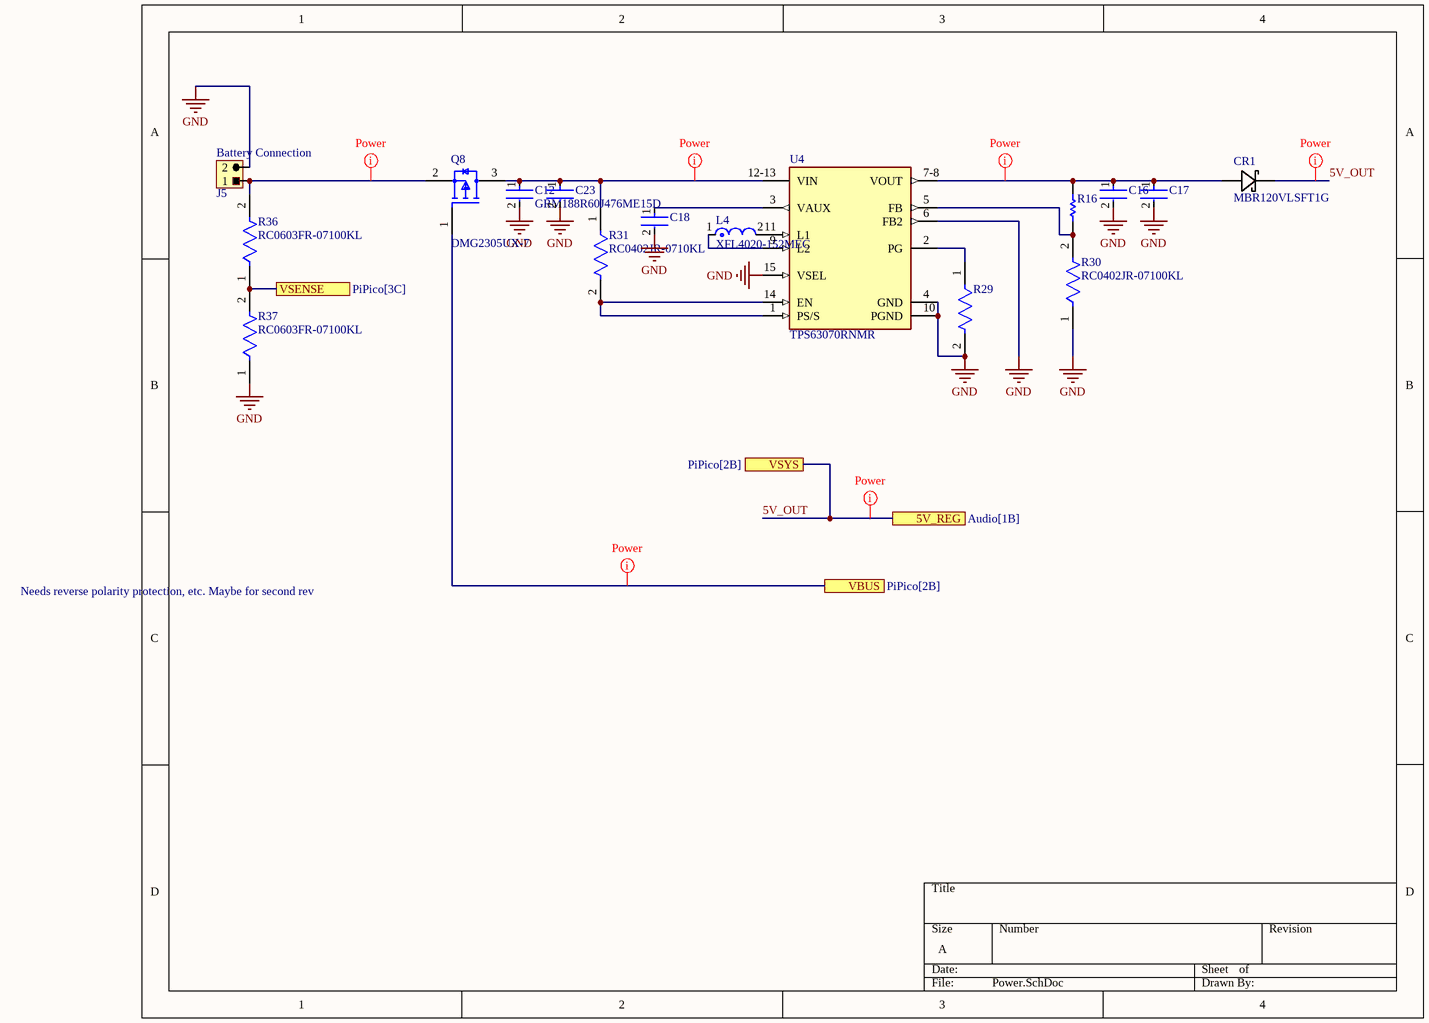
[diagram p3: Power.SchDoc]

### Parts
C12  GRM188R60J476ME15D  [FP-GRM188-0_2-IPC_B]
C16  C0603C106M9PACTU  [FP-C0603C106M9PACTU-MFG]  (value not drawn)
C17  GRM188R60J476ME15D  [FP-GRM188-0_2-IPC_B]  (value not drawn)
C18  C0402C104K8PACTU  [FP-C0402-BB-MFG]  (value not drawn)
C23  C0603C106M9PACTU  [FP-C0603C106M9PACTU-MFG]  (value not drawn)
CR1  MBR120VLSFT1G  [SDO_SOD-123FL_ONS]
J5  Battery Connection  [2-pin Header (Generic)]
L4  XFL4020-152MEC  [FP-XFL4020-MFG]
Q8  DMG2305UX-7  [FP-SOT23-IPC_B]
R16  RC0402FR-07523KL  [RESC1005X40X25NL05T10]  (value not drawn)
R29  RC0402JR-07100KL  [FP-RC0402-0_4-IPC_A]  (value not drawn)
R30  RC0402JR-07100KL  [FP-RC0402-0_4-IPC_A]
R31  RC0402JR-0710KL  [RC0402N_YAG]
R36  RC0603FR-07100KL  [FP-RC0603-0_55-MFG]
R37  RC0603FR-07100KL  [FP-RC0603-0_55-MFG]
U4  TPS63070RNMR  [FP-RNM0015A-MFG]

### Ports
5V_REG (see Audio[1B]), VBUS (see PiPico[2B]), VSENSE (see PiPico[3C]), VSYS (see PiPico[2B])

### Nets
5V_OUT: CR1.1 ; port 5V_REG, port VSYS
GND: C12.2 C16.2 C17.2 C18.2 C23.2 J5.2 R29.2 R30.1 R37.1 U4.4(GND) U4.6(FB2) U4.10(PGND) U4.15(VSEL)
VSENSE: R36.1 R37.2 ; port VSENSE
NetC12_1: C12.1 C23.1 Q8.3(DRAIN) R31.1 U4.12-13(VIN)
NetC16_1: C16.1 C17.1 CR1.2 R16.2 U4.7-8(VOUT)
NetC18_1: C18.1 U4.3(VAUX)
NetJ5_1: J5.1 Q8.2(SOURCE) R36.2
NetL4_1: L4.1 U4.9(L2)
NetL4_2: L4.2 U4.11(L1)
NetQ8_1: Q8.1(GATE) ; port VBUS
NetR16_1: R16.1 R30.2 U4.5(FB)
NetR29_1: R29.1 U4.2(PG)
NetR31_2: R31.2 U4.1(PS/S) U4.14(EN)

### Layout directives
net class POWER: 5V_OUT, NetC12_1, NetC16_1, NetJ5_1, NetQ8_1

### Notes on the sheet
- Needs reverse polarity protection, etc. Maybe for second rev

### Library data of the parts
C12 C17 = CMP-2000-05444-2: Chip Multilayer Ceramic Capacitors for General Purpose, 0603, 47uF, X5R, 15%, 20%, 6.3V; Voltage Rating (DC): 6.3V; Thickness: 0.039inch; Case Code (Imperial): 0603; Packaging: Tape and Reel; Capacitance: 47uF; Width: 0.031inch; Dielectric: X5R; Max Operating Temperature: 85°C; Mount: Surface Mount; Case Code (Metric): 1608; Length: 0.063inch; Voltage Rating: 6.3V; Tolerance: 20%; Case/Package: 0603; Min Operating Temperature: -55°C
C16 C23 = CMP-2006-02285-3: CAP CER 10UF 6.3V X5R 0603; Manufacturer: Kemet; Material: Ceramic; Temperature Coefficient: 15%; Tolerance: 20%; Manufacturer Part Number: C0603C106M9PACTU; Category: Cap; Height: 0.9mm; Digikey Description: CAP CER 10UF 6.3V X5R 0603; Mouser Description: In a Pack of 10, KEMET 0603 (1608M) 10µF MLCC 6.3V dc ±20% SMD C0603C106M9PACTU; Voltage Rating: 6.3V; Device Class L2: Capacitors; Temperature Range Low: -55°C; Temperature Characteristic: X5R; ComponentLink2Description: Datasheet; Ipc Land Pattern Name: CAPC16080X80; ComponentLink2URL: http://www.kemet.com/Lists/ProductCatalog/Attachments/19/KEM_C1006_X5R_SMD.pdf; Capacitance: 10uF; Temperature Range High: +85°C; Device Class L3: Ceramic Capacitors; RoHS: TRUE; Automotive: No; Value: 10uF; Temperature: -55°C to +85°C; Device Class L1: Passive Components; Package: C0603C106M9PACTU; Lead Free: Yes; Octopart: https://octopart.com/c0603c106m9pactu-kemet-8375727
C18 = CMP-2008-02046-2: CAP CER 0.1UF 10V X5R 0402; Manufacturer: Kemet; Material: Ceramic; Capacitance: 0.10 μF; Temperature Coefficient: 15%; Tolerance: 0.1; Value: 0.10 μF; Package: C0402-BB; Temperature: -55°C to +125°C; ComponentLink2Description: Datasheet; Temperature Characteristic: X5R; Device Class L1: Passive Components; Height: 0.55mm; Lead Free: Yes; ComponentLink2URL: https://content.kemet.com/datasheets/KEM_C1002_X7R_SMD.pdf; Device Class L2: Capacitors; Temperature Range Low: -55°C; Temperature Range High: +125°C; RoHS: TRUE; Octopart: https://octopart.com/c0402c104k8pactu-kemet-140039; Automotive: No; Mouser Description: Capacitor 100 nF 10 VDC 0402; Category: Cap; Voltage Rating: 10 V; Digikey Description: CAP CER 0.1UF 10V X5R 0402; Ipc Land Pattern Name: CAPC10050X50; Device Class L3: Ceramic Capacitors; Manufacturer Part Number: C0402C104K8PACTU
CR1 = MBR120VLSFT1G: No Description Available; Mfr_Name: onsemi
J5 = 2-PIN HEADER
L4 = CMP-11268-000104-1: Inductor Power Shielded Wirewound 1.5uH 20% 100KHz 9.1A 15.8mOhm DCR 1515 Automotive Embossed Plastic T/R; Core Material: Composite; DC Resistance (DCR): 15.8mR; Saturation Current: 4.1A; Self Resonant Frequency: 59MHz; Tolerance: 20%; Inductance: 1.5uH; Max DC Current: 9.1A; RoHS Compliant: Yes; Max Operating Temperature: 125°C; Length: 4.3mm; Case/Package: SMD/SMT; Mount: Surface Mount; Shielding: Shielded; Min Operating Temperature: -40°C; RMS Current (Irms): 9.1A; Test Frequency: 100kHz; Inductance Tolerance: 20%; REACH SVHC: No SVHC; Packaging: Tape and Reel; Termination: SMD/SMT; Lead Free: Contains Lead; Width: 4.3mm; Series: XFL4020; Height: 2.1mm
Q8 = CMP-1693-00002-4: MOSFET P-CH 20V 4.2A SOT23; Turn-On Delay Time: 10.8ns; Turn-Off Delay Time: 79.3ns; Threshold Voltage: -900mV; Rise Time: 13.7ns; Gate to Source Voltage (Vgs): 8V; Rds On Max: 52mR; Element Configuration: Single; Fall Time: 34.7ns; Max Power Dissipation: 1.4W; Drain to Source Resistance: 200mR; Number of Channels: 1; Input Capacitance: 808pF; Lead Free: Lead Free; Number of Pins: 3; Length: 3mm; Continuous Drain Current (ID): 4.2A; Contact Plating: Tin; Mount: Surface Mount; Weight: 0.000282oz; Min Operating Temperature: -55°C; Package Quantity: 3000; Drain to Source Voltage (Vdss): 20V; On-State Resistance: 52MR; Max Operating Temperature: 150°C; Height: 1.1mm; REACH SVHC: No SVHC; Packaging: Tape and Reel; Radiation Hardening: No; Case/Package: SOT-23; Width: 1.4mm
R16 = CMP-2002-07734-1: Manufacturer: Yageo / Phycomp; Part Number: RC0402FR-07523KL
R29 R30 = CMP-2002-07913-2: RES 100K OHM 5% 1/16W 0402; Temperature Coefficient: 100ppm/°C; Max Power Dissipation: 63mW; Resistance: 100kR; Voltage Rating: 50V; Tolerance: 5%; Packaging: Tape and Reel; Termination: SMD/SMT; Case Code (Metric): 1005; Length: 1mm; Power Rating: 63mW; Min Operating Temperature: -55°C; Case/Package: 0402; Construction: Rectangular; Series: RC; Resistance Tolerance: 5%; Height: 0.016inch; Case Code (Imperial): 0402; RoHS Compliant: Yes; Size Code: 0402; Number of Terminations: 2; Features: Moisture Resistant; Width: 0.02inch; Max Operating Temperature: 155°C; Military Standard: Not; Lead Free: Lead Free; Depth: 0.5mm; Package Quantity: 1; Resistor Type: Thick Film
R31 = CMP-2002-07915-3: as R4 on sheet Audio; Size Code: 0402; Resistance Tolerance: 5%; Packaging: Tape and Reel; Case Code (Metric): 1005; Lead Free: Lead Free; Resistor Type: Thick Film; Min Operating Temperature: -55°C; Military Standard: Not; Depth: 0.5mm; Series: RC; Case/Package: 0402; Construction: Rectangular; Number of Terminations: 2; Package Quantity: 1; Termination: SMD/SMT; Length: 0.039inch; Case Code (Imperial): 0402; Height: 0.016inch; Features: Moisture Resistant; RoHS Compliant: Yes; Max Operating Temperature: 155°C; Tolerance: 5%; Width: 0.02inch
R36 R37 = CMP-2100-03662-2: as R33 on sheet Audio; Length: 1.6mm; Lead Free: Lead Free; Number of Terminations: 2; Packaging: Tape and Reel; Voltage Rating: 50V; Termination: SMD/SMT; Width: 0.8mm; Resistor Type: Thick Film; Resistance Tolerance: 1%; Features: Moisture Resistant; Height: 0.45mm; Construction: Rectangular; Case/Package: 0603; Military Standard: Not; Case Code (Imperial): 0603; Series: RC; Technology: THICK FILM; Depth: 0.8mm; RoHS Compliant: Yes; REACH SVHC: No SVHC; Min Operating Temperature: -55°C; Case Code (Metric): 1608; Max Operating Temperature: 155°C; Power Rating: 100mW; Number of Pins: 2; Tolerance: 1%
U4 = CMP-04918-000409-1: IC REG BCK BST ADJ 3.6A 15VQFN; Synchronous Rectifier: Yes; Output Type: Adjustable; Output Current: 2A; Max Input Voltage: 16V; Switching Frequency: 2.4MHz; Min Output Voltage: 2.5V; Output Configuration: Positive; Min Input Voltage: 2V; Topology: Buck-Boost; Number of Outputs: 1; Max Output Voltage: 9V; Quiescent Current: 50uA; Max Operating Temperature: 125°C; Case/Package: VQFN; Number of Pins: 15; RoHS Compliant: Yes; Mount: Surface Mount; Min Operating Temperature: -40°C; Lead Free: Lead Free; Packaging: Tape and Reel

## Sheet PiPico.SchDoc
size B; SheetNumber: 5; SheetTotal: 5
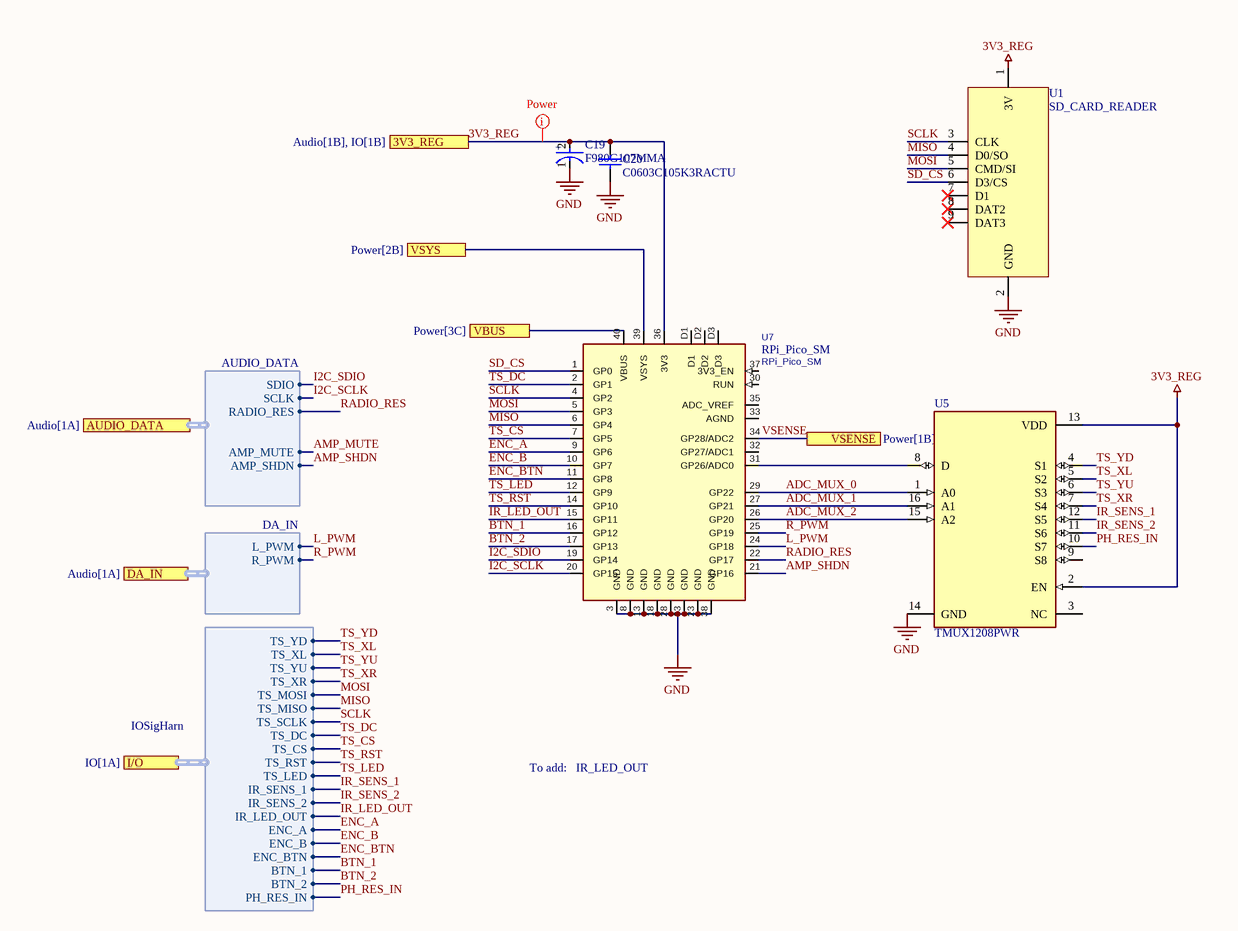
[diagram p4: PiPico.SchDoc]

### Parts
C19  F980G107MMA  [FP-F98M-MFG]
C20  C0603C105K3RACTU  [CAPC1608X87X35LL15T15]
U1  SD_CARD_READER  [6-pin Header (Generic)]
U5  TMUX1208PWR  [FP-PW0016A-IPC_A]
U7  RPi_Pico_SM  [RPi_Pico_SM]

### Ports
3V3_REG (see Audio[1B], IO[1B]), AUDIO_DATA (harness AUDIO_DATA, see Audio[1A]), DA_IN (harness DA_IN, see Audio[1A]), I/O (harness IOSigHarn, see IO[1A]), VBUS (see Power[3C]), VSENSE (see Power[1B]), VSYS (see Power[2B])

### Harnesses
AUDIO_DATA: SDIO, SCLK, AMP_MUTE, AMP_SHDN, RADIO_RES
DA_IN: L_PWM, R_PWM
IOSigHarn: TS_YD, TS_XL, TS_YU, TS_XR, TS_MOSI, TS_MISO, TS_SCLK, TS_DC, TS_CS, TS_RST, TS_LED, IR_SENS_1, IR_SENS_2, IR_LED_OUT, ENC_A, ENC_B, ENC_BTN, BTN_1, BTN_2, PH_RES_IN

### Nets
3V3_REG: C19.2(A) C20.2 U1.1(3V) U5.2(EN) U5.13(VDD) U7.36(3V3) ; port 3V3_REG
5V_OUT: U7.39(VSYS) ; port VSYS
GND: C19.1(C) C20.1 U1.2(GND) U5.14(GND) U7.3(GND) U7.8(GND) U7.13(GND) U7.18(GND) U7.23(GND) U7.28(GND) U7.33(AGND) U7.38(GND)
ADC_MUX_0: U5.1(A0) U7.29(GP22)  [project net ADC_MUX_0_5]
ADC_MUX_1: U5.16(A1) U7.27(GP21)  [project net ADC_MUX_1_5]
ADC_MUX_2: U5.15(A2) U7.26(GP20)  [project net ADC_MUX_2_5]
AMP_SHDN: U7.21(GP16) ; port AUDIO_DATA.AMP_SHDN
BTN_1: U7.16(GP12) ; port I/O.BTN_1
BTN_2: U7.17(GP13) ; port I/O.BTN_2
ENC_A: U7.9(GP6) ; port I/O.ENC_A
ENC_B: U7.10(GP7) ; port I/O.ENC_B
ENC_BTN: U7.11(GP8) ; port I/O.ENC_BTN
I2C_SCLK: U7.20(GP15) ; port AUDIO_DATA.SCLK
I2C_SDIO: U7.19(GP14) ; port AUDIO_DATA.SDIO
IR_LED_OUT: U7.15(GP11) ; port I/O.IR_LED_OUT
IR_SENS_1: U5.12(S5) ; port I/O.IR_SENS_1
IR_SENS_2: U5.11(S6) ; port I/O.IR_SENS_2
L_PWM: U7.24(GP18) ; port DA_IN.L_PWM
MISO: U1.4(D0/SO) U7.6(GP4) ; port I/O.TS_MISO
MOSI: U1.5(CMD/SI) U7.5(GP3) ; port I/O.TS_MOSI
PH_RES_IN: U5.10(S7) ; port I/O.PH_RES_IN
R_PWM: U7.25(GP19) ; port DA_IN.R_PWM
RADIO_RES: U7.22(GP17) ; port AUDIO_DATA.RADIO_RES
SCLK: U1.3(CLK) U7.4(GP2) ; port I/O.TS_SCLK
SD_CS: U1.6(D3/CS) U7.1(GP0)  [project net SD_CS_5]
TS_CS: U7.7(GP5) ; port I/O.TS_CS
TS_DC: U7.2(GP1) ; port I/O.TS_DC
TS_LED: U7.12(GP9) ; port I/O.TS_LED
TS_RST: U7.14(GP10) ; port I/O.TS_RST
TS_XL: U5.5(S2) ; port I/O.TS_XL
TS_XR: U5.7(S4) ; port I/O.TS_XR
TS_YD: U5.4(S1) ; port I/O.TS_YD
TS_YU: U5.6(S3) ; port I/O.TS_YU
VSENSE: U7.34(GP28/ADC2) ; port VSENSE
NetQ8_1: U7.40(VBUS) ; port VBUS
NetU5_8: U5.8(D) U7.31(GP26/ADC0)

Not connected (* = marked no-connect by the designer): U1 7(D1)* 8(DAT2)* 9(DAT3)*; U5 3(NC) 9(S8); U7 30(RUN) 32(GP27/ADC1) 35(ADC_VREF) 37(3V3_EN) D1 D2 D3

### Layout directives
net class POWER: 3V3_REG

### Notes on the sheet
- To add:   IR_LED_OUT
- (in symbol CMP-04424-000012-1) +

### Library data of the parts
C19 = CMP-04424-000012-1: CAP TANT 100UF 20% 4V 0603; Manufacturer: AVX Corporation; Life: 1000Hours; Ripple Current: 50mA; Esr: 10Ω; Leakage Current: 80uA; Temperature Coefficient: 30%; Material: Tantalum; Dissipation Factor: 60%; Device Class L1: Passive Components; ComponentLink2Description: Datasheet; Temperature Range High: +125°C; Octopart: https://octopart.com/f980g107mma-avx-28870482; Capacitance: 100uF; Digikey Description: CAP TANT 100UF 20% 4V 0603; Lead Free: Yes; Device Class L3: Tantalum Capacitors; Package: F98M; Temperature: -55°C to +125°C; Automotive: No; Footprint Url: http://www.avx.com/download/software/literature/AVX-Footprint-Library.pdf; Manufacturer Part Number: F980G107MMA; Tolerance: 20%; Value: 100uF; Category: Cap; Device Class L2: Capacitors; ComponentLink2URL: http://datasheets.avx.com/F98.pdf; Voltage Rating: 4V; Temperature Range Low: -55°C; Height: 0.9mm; RoHS: TRUE
C20 = CMP-2006-03713-1: Manufacturer: Kemet; Part Number: C0603C105K3RACTU
U5 = CMP-04892-000035-1: IC SWITCH SINGLE 16TSSOP; RoHS Compliant: Yes
U7 = RPi_Pico_SM: ki_keywords: Raspberry Pi Pico; Value: RPi_Pico_SM; Footprint: ECE:RPi_Pico_SM; ki_description: Raspberry Pi Pico

## Nets that join several sheets
3V3_REG: Audio (9 pins), IO (12 pins), PiPico (6 pins)
5V_OUT: Audio (10 pins), Power (CR1.1), PiPico (U7.39)
GND: Audio (24 pins), IO (20 pins), Power (13 pins), PiPico (12 pins)
AMP_SHDN: Audio (Q7.6 R28.2), PiPico (U7.21)
BTN_1: IO (SW1.1), PiPico (U7.16)
BTN_2: IO (SW2.1), PiPico (U7.17)
ENC_A: IO (C14.1 R19.1 S1.3), PiPico (U7.9)
ENC_B: IO (C15.1 R18.1 S1.4), PiPico (U7.10)
ENC_BTN: IO (S1.2), PiPico (U7.11)
I2C_SCLK: Audio (U8.11), PiPico (U7.20)
I2C_SDIO: Audio (U8.12), PiPico (U7.19)
IR_LED_OUT: IO (R35.2), PiPico (U7.15)
IR_SENS_1: IO (Q5.3 R20.1), PiPico (U5.12)
IR_SENS_2: IO (Q6.3 R21.1), PiPico (U5.11)
L_PWM: Audio (R2.1), PiPico (U7.24)
MISO: IO (J4.9), PiPico (U1.4 U7.6)
MOSI: IO (J4.8), PiPico (U1.5 U7.5)
NetQ8_1: Power (Q8.1), PiPico (U7.40)
PH_RES_IN: IO (1.2 R34.2), PiPico (U5.10)
R_PWM: Audio (R5.1), PiPico (U7.25)
RADIO_RES: Audio (Q1.2 Q1.5 R43.2 U8.9), PiPico (U7.22)
SCLK: IO (J4.10), PiPico (U1.3 U7.4)
TS_CS: IO (J4.12), PiPico (U7.7)
TS_DC: IO (J4.11), PiPico (U7.2)
TS_LED: IO (Q9.1), PiPico (U7.12)
TS_RST: IO (J4.13), PiPico (U7.14)
TS_XL: IO (J4.3), PiPico (U5.5)
TS_XR: IO (J4.5), PiPico (U5.7)
TS_YD: IO (J4.2), PiPico (U5.4)
TS_YU: IO (J4.4), PiPico (U5.6)
VSENSE: Power (R36.1 R37.2), PiPico (U7.34)

## Assembly variants
Main ECE299_PCB: all parts fitted
RDA5807: all parts fitted